# EAGLE design FrontXLRBoard (EAGLE 9.6.2)
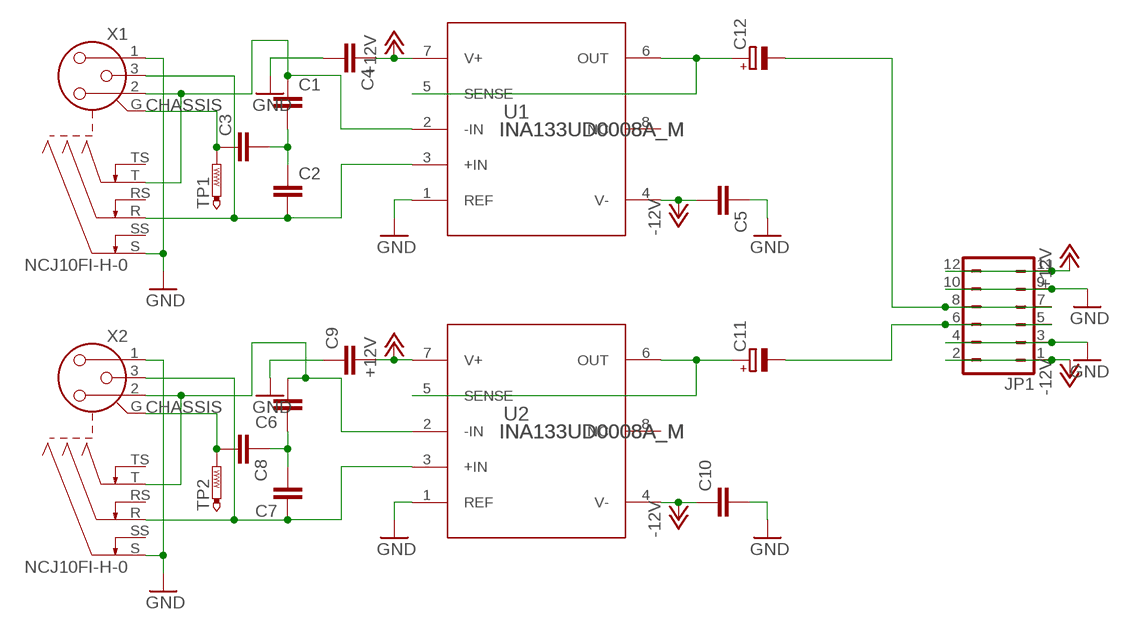
[diagram p0: schematic, sheet 1]

## Parts
C1  C-EUC0805  [C0805]
C2  C-EUC0805  [C0805]
C3  C-EUC0805  [C0805]
C4  C-EUC0805  [C0805]
C5  C-EUC0805  [C0805]
C6  C-EUC0805  [C0805]
C7  C-EUC0805  [C0805]
C8  C-EUC0805  [C0805]
C9  C-EUC0805  [C0805]
C10  C-EUC0805  [C0805]
C11  CPOL-EU153CLV-0807  [153CLV-0807]
C12  CPOL-EU153CLV-0807  [153CLV-0807]
JP1  JP6Q  [JP6Q]
TP1  PTR1PAD1-17  [P1-17]
TP2  PTR1PAD1-17  [P1-17]
U1  INA133UD0008A_M  [D0008A_M]
U2  INA133UD0008A_M  [D0008A_M]
X1  NCJ10FI-H-0  [NCJ10FI-H-0]
X2  NCJ10FI-H-0  [NCJ10FI-H-0]

## Nets
+12V: C4.1 C9.2 JP1.11 JP1.12 U1.7(V+) U2.7(V+)
-12V: C5.2 C10.1 JP1.1 JP1.2 U1.4(V-) U2.4(V-)
CHASSIS: C3.1 C8.2 TP1.TP TP2.TP X1.G X2.G
GND: C4.2 C5.1 C9.1 C10.2 JP1.3 JP1.4 JP1.9 JP1.10 U1.1(REF) U2.1(REF) X1.1 X1.S X2.1 X2.S
N$1: C2.2 U1.3(+IN) X1.3 X1.R
N$2: C1.2 C2.1 C3.2
N$3: C1.1 U1.2(-IN) X1.2 X1.T
N$5: C12.- JP1.7 JP1.8
N$7: C6.1 C7.2 C8.1
N$8: C6.2 U2.2(-IN) X2.2 X2.T
N$9: C7.1 U2.3(+IN) X2.3 X2.R
N$11: C12.+ U1.5(SENSE) U1.6(OUT)
N$12: C11.+ U2.5(SENSE) U2.6(OUT)
N$15: C11.- JP1.5 JP1.6
Unconnected: U1.8(NC) U2.8(NC) X1.RS X1.SS X1.TS X2.RS X2.SS X2.TS

## Library data of the parts
C1-C10 = resistor:C-EU: CAPACITOR, European symbol
C11 C12 = resistor:CPOL-EU: POLARIZED CAPACITOR, European symbol
JP1 = jumper:JP6Q: JUMPER
TP1 TP2 = testpad:PTR1: TEST PIN
U1 U2 = INA133:INA133U; COPYRIGHT: Copyright (C) 2021 Ultra Librarian. All rights reserved.; MANUFACTURER_PART_NUMBER: INA133U; MFR_NAME: Texas Instruments; REFDES: RefDes; TYPE: TYPE
X1 X2 = con-neutrik_ag:NCJ10FI-: Neutrik Audio Connector XLR SERIES Stereo 1/4" jack with switch Source: www.neutrik.com/; MPN: NCJ10FI-H-0; OC_FARNELL: unknown; OC_NEWARK: 99B1398

## Board
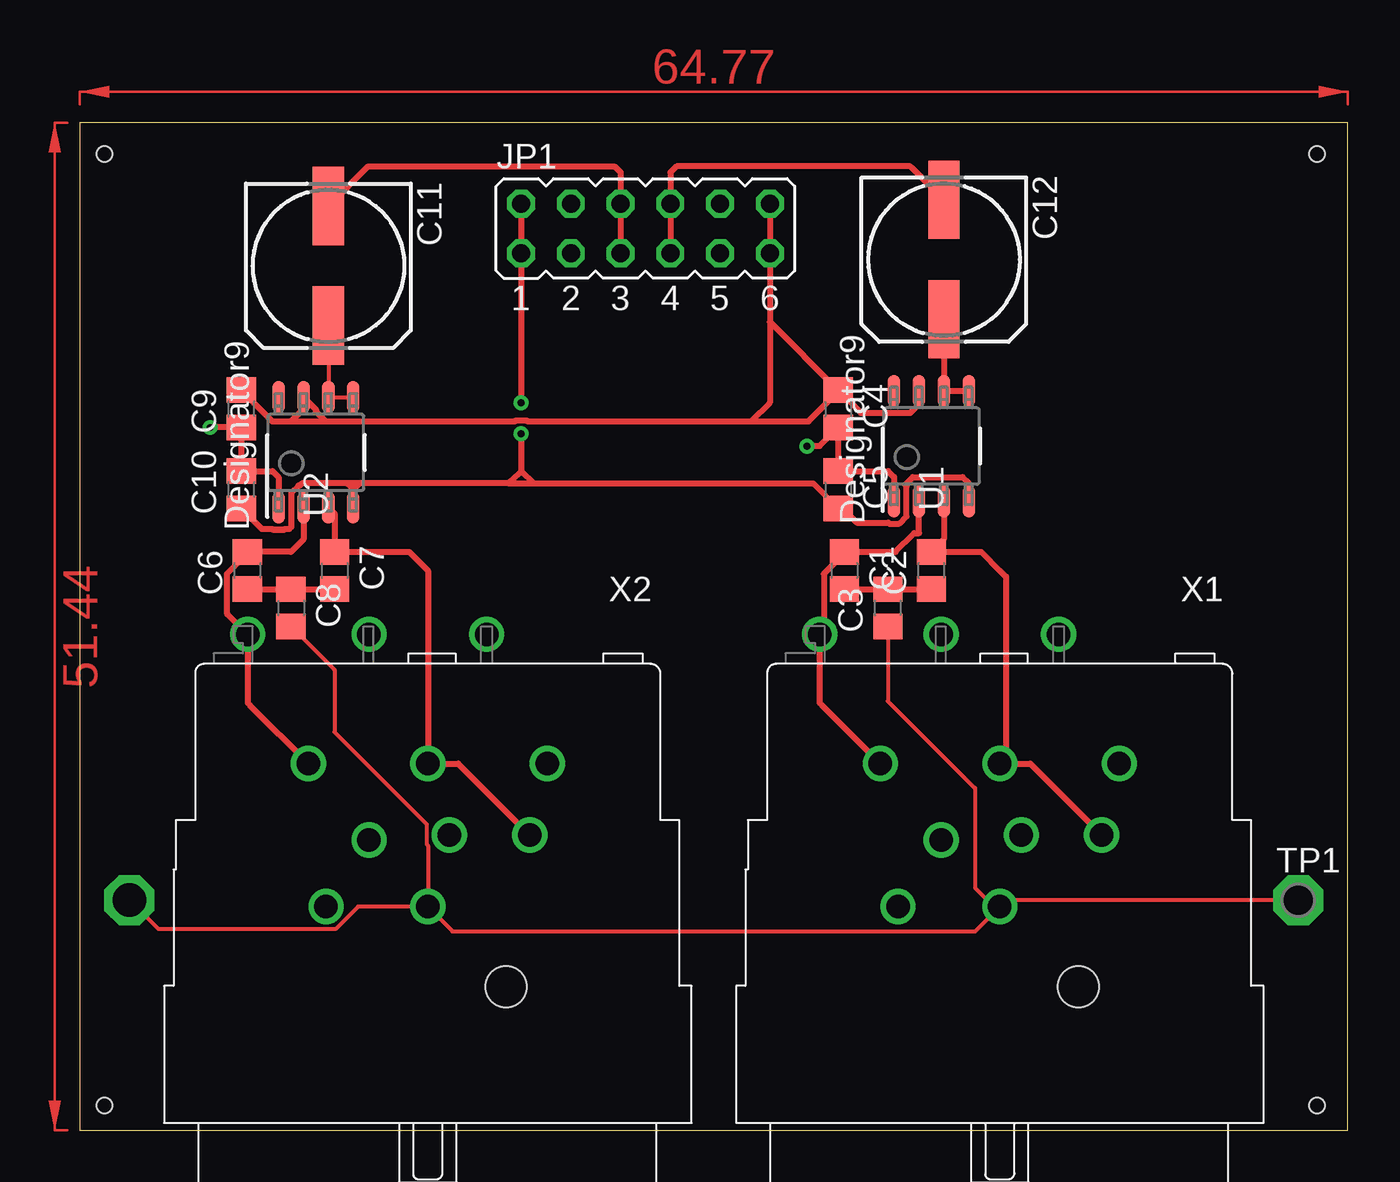
[diagram p1: board, top side]
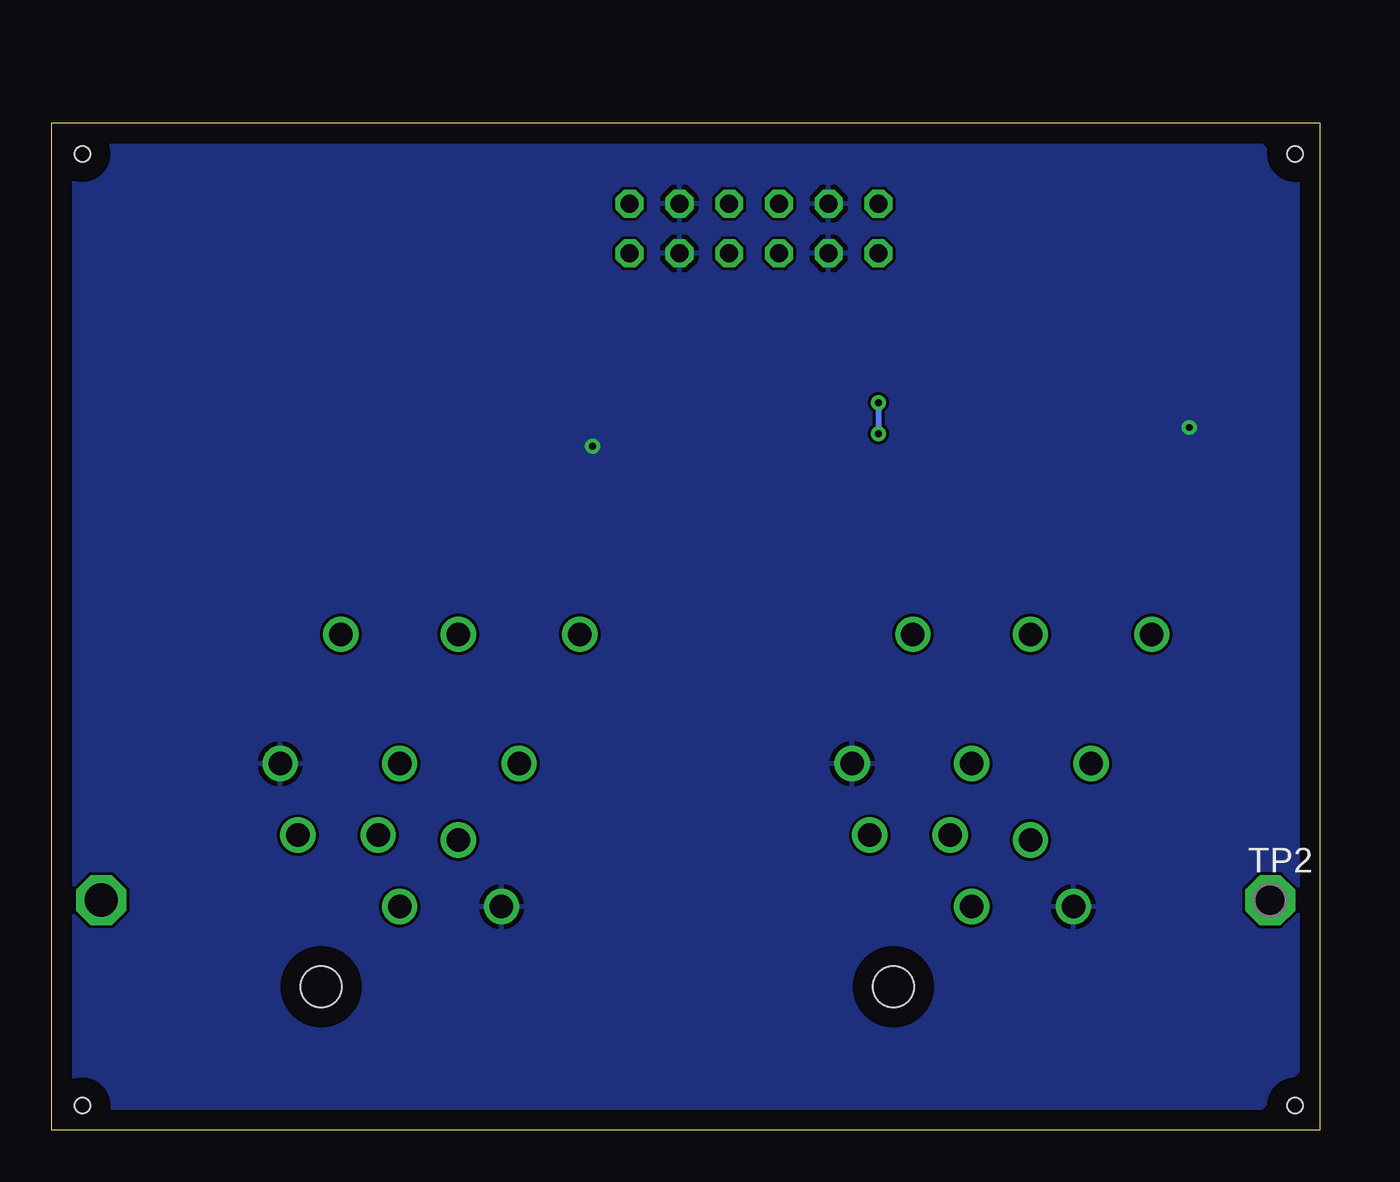
[diagram p2: board, bottom side, seen from below]

Size 64.75 x 51.42 mm. Coordinates in mm from the lower left corner, seen from the top.
Outline: 0,0 64.75,0 64.75,51.42 0,51.42 0,0
Copper layers (1*16): Top 0.035mm / dielectric 1.5mm / Bottom 0.035mm
Design rules "default": minimum track width 6mil, minimum drill 0.35mm, track to track 6mil, track to pad 6mil, pad to pad 6mil, via to via 6mil, smd to smd 6mil, copper to edge 40mil, drill to drill 6mil, minimum pad ring 10mil, minimum via ring 8mil, stop-mask expansion 4mil, vias tented up to drill 0mil, thermal gap 10mil
Holes 0.8 mm at 1.27,49.85 63.18,49.85 63.18,1.27 1.27,1.27

### Footprints (pad centres in the part's own frame; a part is rotated, then mirrored left to right if it is on the bottom)
C0805 = smd 1.3 x 1.5: 1 -0.95,0; 2 0.95,0
153CLV-0807 = smd 4 x 1.6: + 3.05,0; - -3.05,0
JP6Q = drill 0.914 octagon: 1 -6.35,-1.27; 2 -6.35,1.27; 3 -3.81,-1.27; 4 -3.81,1.27; 5 -1.27,-1.27; 6 -1.27,1.27; 7 1.27,-1.27; 8 1.27,1.27; 9 3.81,-1.27; 10 3.81,1.27; 11 6.35,-1.27; 12 6.35,1.27
P1-17 = drill 1.702 pad 2.54 octagon: TP 0,0
D0008A_M = smd 1.65 x 0.65: 1 -2.825,1.905; 2 -2.825,0.635; 3 -2.825,-0.635; 4 -2.825,-1.905; 5 2.825,-1.905; 6 2.825,-0.635; 7 2.825,0.635; 8 2.825,1.905
NCJ10FI-H-0 = drill 1.2: 1 -6.1,-18.4; 2 6.1,-18.4; 3 0,-18.4; G 0,-11.1; GN -1.1,-14.75; R -5.2,-14.75; RS -3,-25; S 5.2,-11.1; SS 3,-14.5; T 9.2,-25; TS 3,-25 | hole 2.1: -4,-7

### Placement (x,y rotation side)
C1  39.05,28.57 270 top
C2  43.5,28.57 90 top
C3  41.27,26.67 90 top
C4  38.73,36.83 270 top
C5  38.73,32.7 270 top
C6  8.57,28.57 90 top
C7  13.02,28.57 270 top
C8  10.79,26.67 270 top
C9  8.26,36.83 90 top
C10  8.26,32.7 90 top
C11  12.7,44.13 270 top
C12  44.13,44.45 270 top
JP1  28.89,46.04 0 top
TP1  62.23,11.75 0 top
TP2  2.54,11.75 0 bottom
U1  43.5,34.93 90 top
U2  12.06,34.61 90 top
X1  46.99,0.32 180 top
X2  17.78,0.32 180 top

### Tracks (layer width: path | path; a pad name or v marks a point on that pad's centre or on a via)
+12V
  Top 0.203: U2.7 11.43,36.83 | 42.86,37.07 U1.7 | 33.97,36.19 12.62,36.19 | JP1.11 35.24,41.27 35.24,37.15
  Top 0.305: JP1.12 JP1.11 35.24,37.15 34.29,36.19 | 34.29,36.19 33.97,36.19 22.87,36.19 22.83,36.24 22.26,36.24 22.21,36.19 12.62,36.19 12.55,36.19 | 34.29,36.19 37.22,36.19 38.73,37.71 C4.1 | 35.24,41.27 C4.1 | C9.2 9.84,36.19 10.79,36.19 | 11.43,36.83 10.79,36.19 | U2.7 12.07,36.79 12.07,36.67 12.55,36.19 | 10.79,36.19 12.55,36.19 | 42.86,37.07 42.42,36.62 39.9,36.62 C4.1
-12V  (via drill 0.35)
  Top 0.203: 11.35,33.02 10.85,32.52 10.85,30.85 10.7,30.7 9.3,30.7 | C5.2
  Top 0.305: v22.54,37.15 JP1.1 JP1.2 | v22.54,35.56 22.54,33.65 | 22.54,33.65 22.07,33.18 | 22.07,33.18 21.91,33.02 | 22.54,33.65 23.18,33.02 | 22.07,33.18 22.23,33.02 | 21.91,33.02 22.23,33.02 | 22.23,33.02 23.18,33.02 | 21.91,33.02 14.29,33.02 | 14.29,33.02 13.97,32.7 | 13.97,32.7 U2.4 | 14.29,33.02 13.65,33.02 | 13.97,32.7 13.65,33.02 | 13.65,33.02 11.35,33.02 11.24,32.91 11.17,32.91 10.8,32.54 10.8,30.8 10.7,30.7 10.47,30.7 10.42,30.65 9.9,30.65 9.85,30.7 9.3,30.7 C10.1 | C5.2 38.96,31.75 39.69,31.02 41.28,31.02 41.33,30.97 41.85,30.97 42.22,31.34 42.22,32.86 42.17,32.91 42.17,32.96 42.55,33.34 45.09,33.34 45.4,33.02 U1.4 | 23.18,33.02 37.47,33.02 C5.2
  Bottom 0.305: v22.54,37.15 v22.54,35.56
CHASSIS
  Top 0.203: X2.G 19.04,10.16 45.73,10.16 46.84,11.26 | 46.84,11.26 X1.G 47.32,11.75 TP1.TP | X2.G 14.21,11.42 13.06,10.26 4.02,10.26 TP2.TP | C8.2 13.02,23.5 13.02,20.32 17.73,15.61 17.73,14.59 17.78,14.54 X2.G | C3.1 41.27,21.91 45.72,17.46 45.72,12.38 46.84,11.26
GND  (via drill 0.35)
  Top 0.305: U2.1 10.16,33.34 9.85,33.65 C10.2 C9.1 v6.67,35.88 | U1.1 41.59,33.34 41.28,33.65 C5.1 C4.2 37.78,34.93 v37.15,34.93
  pour Bottom: 3.49,50.8 0.63,47.94 0.63,44.13 0.63,3.49 3.17,0.95 62.55,0.95 64.14,2.54 64.14,48.9 62.23,50.8
N$1
  Top 0.305: U1.3 44.13,30.16 C2.2 46.04,29.52 46.99,28.58 47.31,28.26 47.31,18.72 | X1.3 47.31,18.72 | 47.31,18.72 48.54,18.72 X1.R
N$2
  Top 0.203: C3.2
  Top 0.305: C1.2 C3.2 | C3.2 C2.1
N$3
  Top 0.203: 37.79,21.82 37.9,21.71
  Top 0.305: U1.2 42.86,30.48 42.62,30.48 41.67,29.52 C1.1 39.05,29.46 38,28.4 38,25.53 X1.T 37.79,21.82 | 37.9,21.71 X1.2
N$5
  Top 0.203: 42.48,49.15 42.42,49.21
  Top 0.305: JP1.7 JP1.8 30.16,48.9 30.48,49.21 42.42,49.21 | C12.- 42.48,49.15
N$7
  Top 0.305: C6.1 C8.1 C7.2
N$8
  Top 0.203: 8.58,21.82 8.69,21.71 | 8.89,29.52 C6.2
  Top 0.305: U2.2 11.43,30.16 10.79,29.52 8.89,29.52 | C6.2 8.57,29.46 7.52,28.4 7.52,26.38 7.57,26.33 X2.T 8.58,21.82 | 8.69,21.71 X2.2
N$9
  Top 0.203: 17.78,28.58 16.83,29.53 C7.1 | C7.1 | U2.3 13.02,31.46 C7.1
  Top 0.305: U2.3 13.02,31.46 C7.1 | C7.1 16.83,29.52 17.78,28.58 X2.3 19.33,18.72 X2.R
N$11
  Top 0.305: C12.+ U1.6 U1.5
N$12
  Top 0.203: U2.5 U2.6 C11.+
N$15
  Top 0.305: C11.- 14.73,49.21 27.3,49.21 27.62,48.9 JP1.6 JP1.5
(copper drawn outside any net)
  shapes: Top area x2